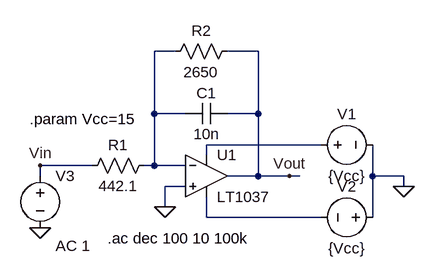
[diagram p0: schematic scheme1.asc]
scheme1.asc, the LTspice schematic file:
Version 4.1
SHEET 1 880 680
WIRE 144 -16 112 -16
WIRE 272 -16 224 -16
WIRE 112 80 112 -16
WIRE 160 80 112 80
WIRE 272 80 272 -16
WIRE 272 80 224 80
WIRE 368 128 192 128
WIRE 192 144 192 128
WIRE 16 160 -64 160
WIRE 112 160 112 80
WIRE 112 160 96 160
WIRE 160 160 112 160
WIRE -64 176 -64 160
WIRE 272 176 272 80
WIRE 272 176 224 176
WIRE 320 176 272 176
WIRE 336 176 320 176
WIRE 448 176 448 128
WIRE 496 176 448 176
WIRE 160 192 128 192
WIRE 496 192 496 176
WIRE 128 224 128 192
WIRE 192 240 192 208
WIRE 368 240 192 240
WIRE 448 240 448 176
FLAG 496 192 0
FLAG 128 224 0
FLAG -64 256 0
FLAG -64 160 Vin
FLAG 320 176 Vout
SYMBOL OpAmps\\LT1037 192 112 R0
SYMATTR InstName U1
SYMBOL voltage 352 128 R270
WINDOW 0 32 56 VTop 2
WINDOW 3 -32 56 VBottom 2
SYMATTR InstName V1
SYMATTR Value {Vcc}
SYMBOL voltage 464 240 R90
WINDOW 0 -32 56 VBottom 2
WINDOW 3 32 56 VTop 2
SYMATTR InstName V2
SYMATTR Value {Vcc}
SYMBOL cap 224 64 R90
WINDOW 0 0 32 VBottom 2
WINDOW 3 32 32 VTop 2
SYMATTR InstName C1
SYMATTR Value 10n
SYMBOL res 112 144 R90
WINDOW 0 0 56 VBottom 2
WINDOW 3 32 56 VTop 2
SYMATTR InstName R1
SYMATTR Value 442.1
SYMBOL res 240 -32 R90
WINDOW 0 0 56 VBottom 2
WINDOW 3 32 56 VTop 2
SYMATTR InstName R2
SYMATTR Value 2650
SYMBOL voltage -64 160 R0
WINDOW 123 24 124 Left 2
WINDOW 39 0 0 Left 0
SYMATTR InstName V3
SYMATTR Value ""
SYMATTR Value2 AC 1
TEXT -80 88 Left 2 !.param Vcc=15
TEXT 40 272 Left 2 !.ac dec 100 10 100k

The netlist it stands for:
* scheme1.asc
X§U1 0 N001 N002 N003 Vout LT1037  ; pins In+ In- V+ V- OUT
V1 N002 0 {Vcc}
V2 0 N003 {Vcc}
C1 Vout N001 10n
R1 N001 Vin 442.1
R2 Vout N001 2650
V3 Vin 0 AC 1
.param Vcc=15
.ac dec 100 10 100k
.backanno
.end